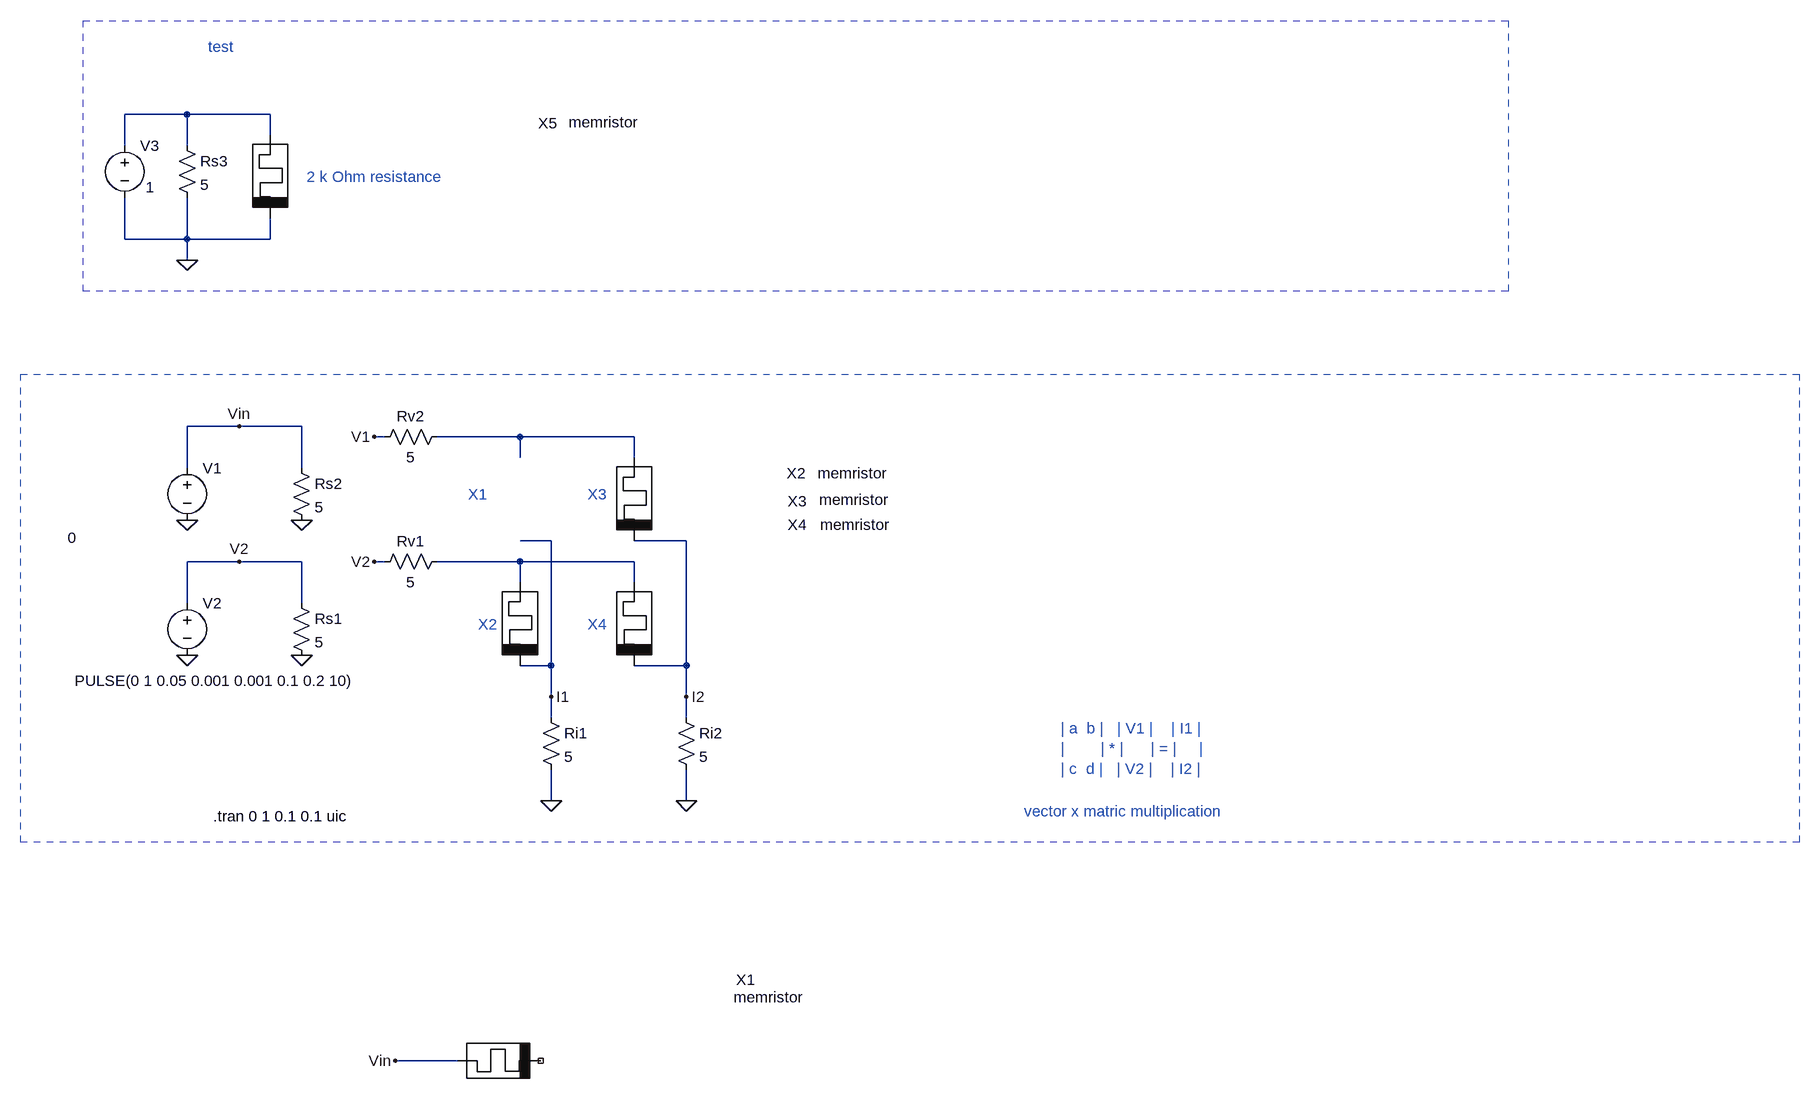
[diagram p0: schematic Simulation.asc]
Simulation.asc, the LTspice schematic file:
Version 4
SHEET 1 2596 748
WIRE 112 -768 16 -768
WIRE 240 -768 112 -768
WIRE 240 -736 240 -768
WIRE 16 -720 16 -768
WIRE 112 -720 112 -768
WIRE 16 -576 16 -640
WIRE 112 -576 112 -640
WIRE 112 -576 16 -576
WIRE 240 -576 240 -608
WIRE 240 -576 112 -576
WIRE 112 -544 112 -576
WIRE 192 -288 112 -288
WIRE 288 -288 192 -288
WIRE 416 -272 400 -272
WIRE 624 -272 496 -272
WIRE 800 -272 624 -272
WIRE 624 -240 624 -272
WIRE 800 -240 800 -272
WIRE 112 -224 112 -288
WIRE 288 -224 288 -288
WIRE 672 -112 624 -112
WIRE 880 -112 800 -112
WIRE 192 -80 112 -80
WIRE 288 -80 192 -80
WIRE 416 -80 400 -80
WIRE 624 -80 496 -80
WIRE 800 -80 624 -80
WIRE 624 -48 624 -80
WIRE 800 -48 800 -80
WIRE 112 -16 112 -80
WIRE 288 -16 288 -80
WIRE 672 80 672 -112
WIRE 672 80 624 80
WIRE 880 80 880 -112
WIRE 880 80 800 80
WIRE 672 128 672 80
WIRE 880 128 880 80
WIRE 672 160 672 128
WIRE 880 160 880 128
WIRE 672 288 672 240
WIRE 880 288 880 240
WIRE 528 688 432 688
FLAG 288 64 0
FLAG 112 64 0
FLAG 288 -144 0
FLAG 112 -144 0
FLAG 192 -80 V2
FLAG 192 -288 Vin
FLAG 400 -80 V2
FLAG 400 -272 V1
FLAG 672 128 I1
FLAG 880 128 I2
FLAG 672 288 0
FLAG 880 288 0
FLAG 112 -544 0
FLAG 432 688 Vin
SYMBOL res 272 -32 R0
SYMATTR InstName Rs1
SYMATTR Value 5
SYMBOL voltage 112 -32 R0
WINDOW 123 0 0 Left 0
WINDOW 39 0 0 Left 0
WINDOW 3 -173 135 Left 2
SYMATTR Value PULSE(0 1 0.05 0.001 0.001 0.1 0.2 10)
SYMATTR InstName V2
SYMBOL memristor 800 -176 R0
WINDOW 3 284 1 Left 2
WINDOW 39 422 2 Left 2
WINDOW 0 236 3 Left 2
SYMATTR InstName X3
SYMBOL memristor 800 16 R0
WINDOW 3 286 -153 Left 2
WINDOW 39 422 -152 Left 2
WINDOW 0 236 -153 Left 2
SYMATTR InstName X4
SYMBOL memristor 592 688 R270
WINDOW 3 98 361 VRight 2
WINDOW 39 68 364 VRight 2
WINDOW 0 125 365 VRight 2
SYMATTR InstName X1
SYMBOL memristor 624 16 R0
WINDOW 3 458 -232 Left 2
WINDOW 39 596 -232 Left 2
WINDOW 0 410 -232 Left 2
SYMATTR InstName X2
SYMBOL res 272 -240 R0
SYMATTR InstName Rs2
SYMATTR Value 5
SYMBOL voltage 112 -240 R0
WINDOW 123 0 0 Left 0
WINDOW 39 0 0 Left 0
WINDOW 3 -184 123 Left 2
SYMATTR Value 0
SYMATTR InstName V1
SYMBOL res 656 144 R0
SYMATTR InstName Ri1
SYMATTR Value 5
SYMBOL res 864 144 R0
SYMATTR InstName Ri2
SYMATTR Value 5
SYMBOL res 512 -288 R90
WINDOW 0 0 56 VBottom 2
WINDOW 3 32 56 VTop 2
SYMATTR InstName Rv2
SYMATTR Value 5
SYMBOL res 512 -96 R90
WINDOW 0 0 56 VBottom 2
WINDOW 3 32 56 VTop 2
SYMATTR InstName Rv1
SYMATTR Value 5
SYMBOL memristor 240 -672 R0
WINDOW 3 459 -84 Left 2
WINDOW 39 596 -83 Left 2
WINDOW 0 412 -82 Left 2
SYMATTR InstName X5
SYMBOL voltage 16 -736 R0
WINDOW 123 0 0 Left 0
WINDOW 39 0 0 Left 0
WINDOW 3 32 80 Left 2
SYMATTR Value 1
SYMATTR InstName V3
SYMBOL res 96 -736 R0
SYMATTR InstName Rs3
SYMATTR Value 5
TEXT 152 312 Left 2 !.tran 0 1 0.1 0.1 uic
TEXT 544 -184 Left 2 ;X1
TEXT 728 -184 Left 2 ;X3
TEXT 560 16 Left 2 ;X2
TEXT 728 16 Left 2 ;X4
TEXT 296 -672 Left 2 ;2 k Ohm resistance
TEXT 144 -872 Left 2 ;test
TEXT 1400 304 Left 2 ;vector x matric multiplication
TEXT 1456 176 Left 2 ;| a  b |   | V1 |    | I1 |\n|        | * |      | = |     |\n| c  d |   | V2 |    | I2 |
RECTANGLE Normal 2144 -496 -48 -912 2
RECTANGLE Normal 2592 352 -144 -368 2

The netlist it stands for:
* Simulation.asc
Rs1 V2 0 5
V2 V2 0 PULSE(0 1 0.05 0.001 0.001 0.1 0.2 10)
XX3 N002 I2 memristor  ; pins plus minus
XX4 N003 I2 memristor  ; pins plus minus
XX1 Vin NC_01 memristor  ; pins plus minus
XX2 N003 I1 memristor  ; pins plus minus
Rs2 Vin 0 5
V1 Vin 0 0
Ri1 I1 0 5
Ri2 I2 0 5
Rv2 N002 V1 5
Rv1 N003 V2 5
XX5 N001 0 memristor  ; pins plus minus
V3 N001 0 1
Rs3 N001 0 5
.tran 0 1 0.1 0.1 uic
* X1
* X3
* X2
* X4
* 2 k Ohm resistance
* test
* vector x matric multiplication
* | a  b |   | V1 |    | I1 |
* |        | * |      | = |     |
* | c  d |   | V2 |    | I2 |
.backanno
.end